# EAGLE design lpc1114 basic (EAGLE 6.3)
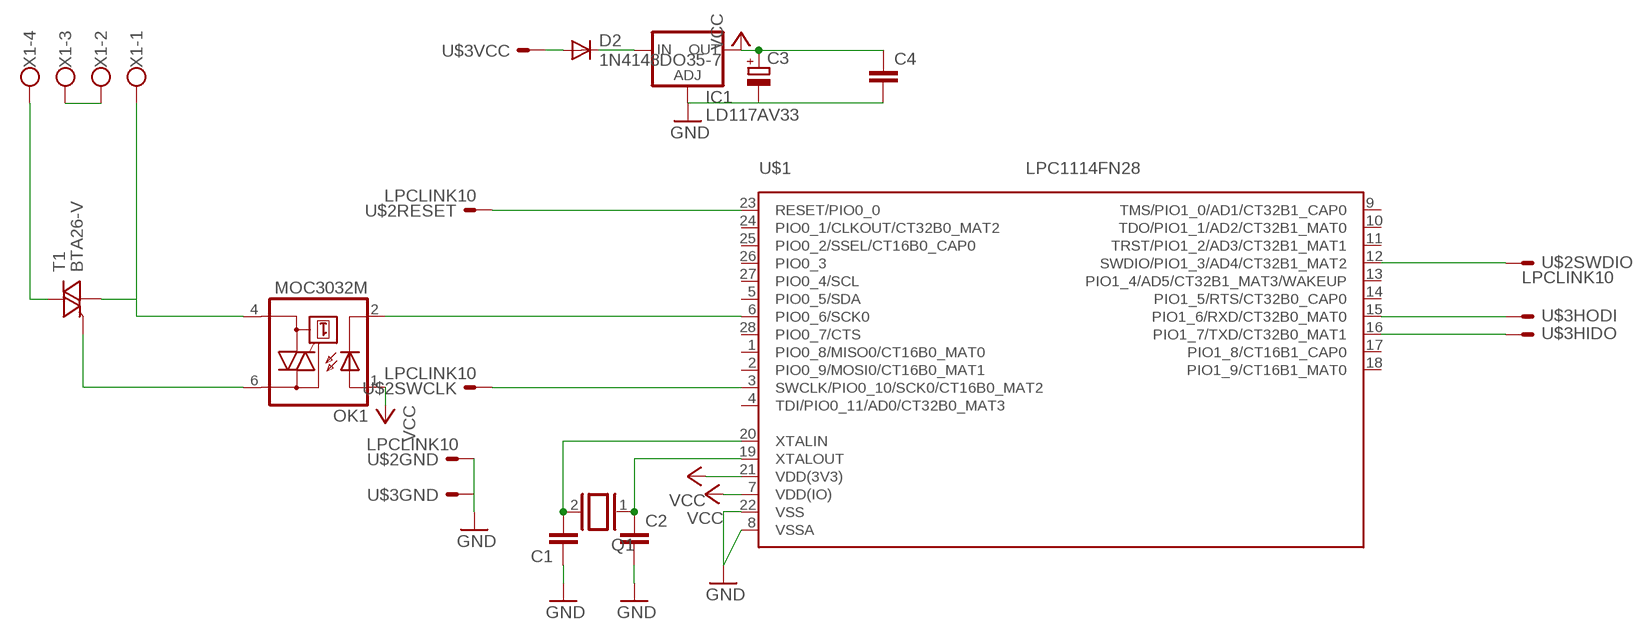
[diagram p0: schematic, sheet 1]

## Parts
C1  C-EU025-024X044  [C025-024X044]
C2  C-EU025-024X044  [C025-024X044]
C3  CPOL-EUTT2D6  [TT2D6]
C4  C-EU050-024X044  [C050-024X044]
D2  1N4148DO35-7  [DO35-7]
IC1  LD117AV33  [TO220L1]
OK1  MOC3032M  [DIL06]
Q1  XTAL/S  [QS]
T1  BTA26-V  [TOP3S-1]
U$1  LPC1114FN28  [DIP28]
U$2  LPCLINK10  [ML10]
U$3  UARTUSB  [PN61729]
X1  W237-4  [W237-4]

## Nets
GND: C1.1 C2.2 C3.- C4.2 IC1.1(ADJ) U$1.8(VSSA) U$1.22(VSS) U$2.9 U$3.4
N$1: C1.2 Q1.2 U$1.20(XTALIN)
N$2: C2.1 Q1.1 U$1.19(XTALOUT)
N$3: U$1.15(PIO1_6/RXD/CT32B0_MAT0) U$3.3
N$4: U$1.16(PIO1_7/TXD/CT32B0_MAT1) U$3.2
N$5: U$1.3(SWCLK/PIO0_10/SCK0/CT16B0_MAT2) U$2.4
N$6: U$1.12(SWDIO/PIO1_3/AD4/CT32B1_MAT2) U$2.2
N$7: U$1.23(RESET/PIO0_0) U$2.10
N$8: D2.A U$3.1
N$9: OK1.6(A2) T1.G
N$10: D2.C IC1.3(IN)
N$11: T1.A2 X1.4
N$12: OK1.2(C) U$1.6(PIO0_6/SCK0)
N$13: OK1.4(A1) T1.A1 X1.1
N$14: X1.2 X1.3
VCC: C3.+ C4.1 IC1.2(OUT) OK1.1(A) U$1.7(VDD(IO)) U$1.21(VDD(3V3))
Unconnected: U$1.1(PIO0_8/MISO0/CT16B0_MAT0) U$1.2(PIO0_9/MOSI0/CT16B0_MAT1) U$1.4(TDI/PIO0_11/AD0/CT32B0_MAT3) U$1.5(PIO0_5/SDA) U$1.9(TMS/PIO1_0/AD1/CT32B1_CAP0) U$1.10(TDO/PIO1_1/AD2/CT32B1_MAT0) U$1.11(TRST/PIO1_2/AD3/CT32B1_MAT1) U$1.13(PIO1_4/AD5/CT32B1_MAT3/WAKEUP) U$1.14(PIO1_5/RTS/CT32B0_CAP0) U$1.17(PIO1_8/CT16B1_CAP0) U$1.18(PIO1_9/CT16B1_MAT0) U$1.24(PIO0_1/CLKOUT/CT32B0_MAT2) U$1.25(PIO0_2/SSEL/CT16B0_CAP0) U$1.26(PIO0_3) U$1.27(PIO0_4/SCL) U$1.28(PIO0_7/CTS)

## Library data of the parts
C1 C2 C4 = rcl:C-EU: CAPACITOR, European symbol
C3 = rcl:CPOL-EU: POLARIZED CAPACITOR, European symbol
D2 = diode:1N4148: DIODE high speed (Philips)
IC1 = v-reg:LD117A?*: Low drop fixed and adjustable positive voltage regulators 1 A Source: http://www.st.com/stonline/products/literature/ds/7194/ld1117axx.pdf
OK1 = optocoupler:MOC30*: 6-Pin DIP Zero-Cross Optoisolators Triac Driver Output (250/400 Volt Peak) Source: http://www.fairchildsemi.com/ds/MO/MOC3043-M.pdf; MF: FAIRCHILD SEMICONDUCTOR; MPN: MOC3032-M; OC_FARNELL: 1203802; OC_NEWARK: 72K8897
Q1 = special:XTAL/S: CRYSTAL
T1 = triac:BTA26: 25A TRIAC Source: http://www.st.com/stonline/products/literature/ds/7470.pdf
U$1 = lieven:LPC1114FN28: LPC1114FN28
U$2 = lieven:LPCLINK10
U$3 = lieven:UARTUSB
X1 = con-wago-500:W237-4: WAGO SCREW CLAMP; OC_FARNELL: unknown; OC_NEWARK: unknown

## Board
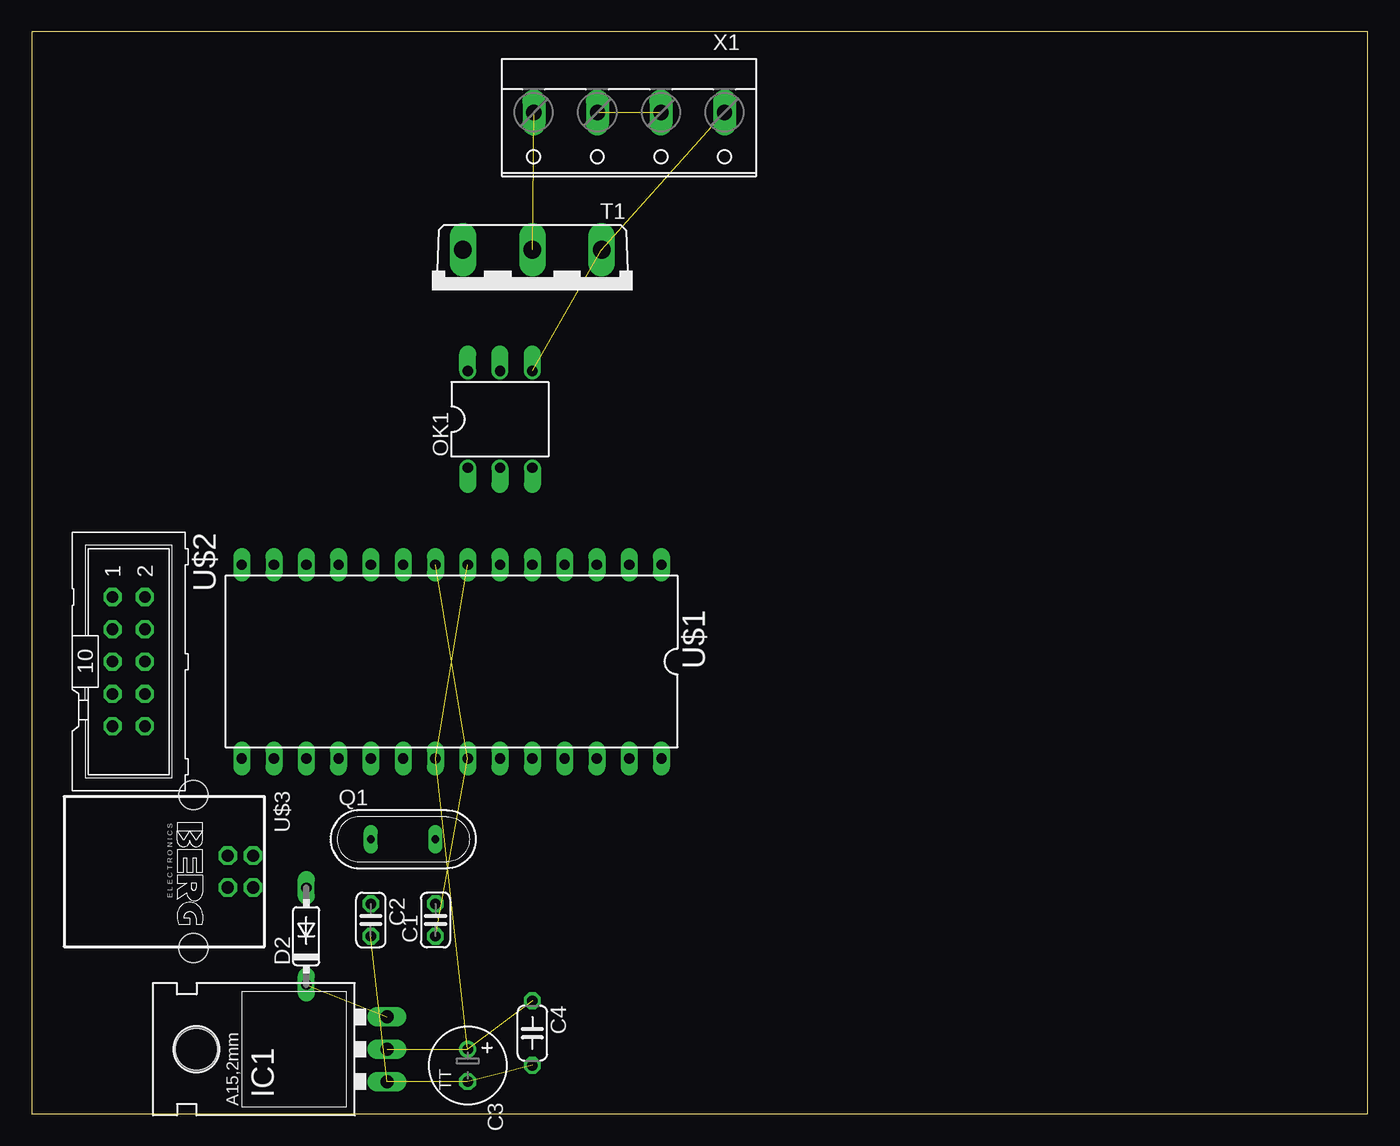
[diagram p1: board, top side]
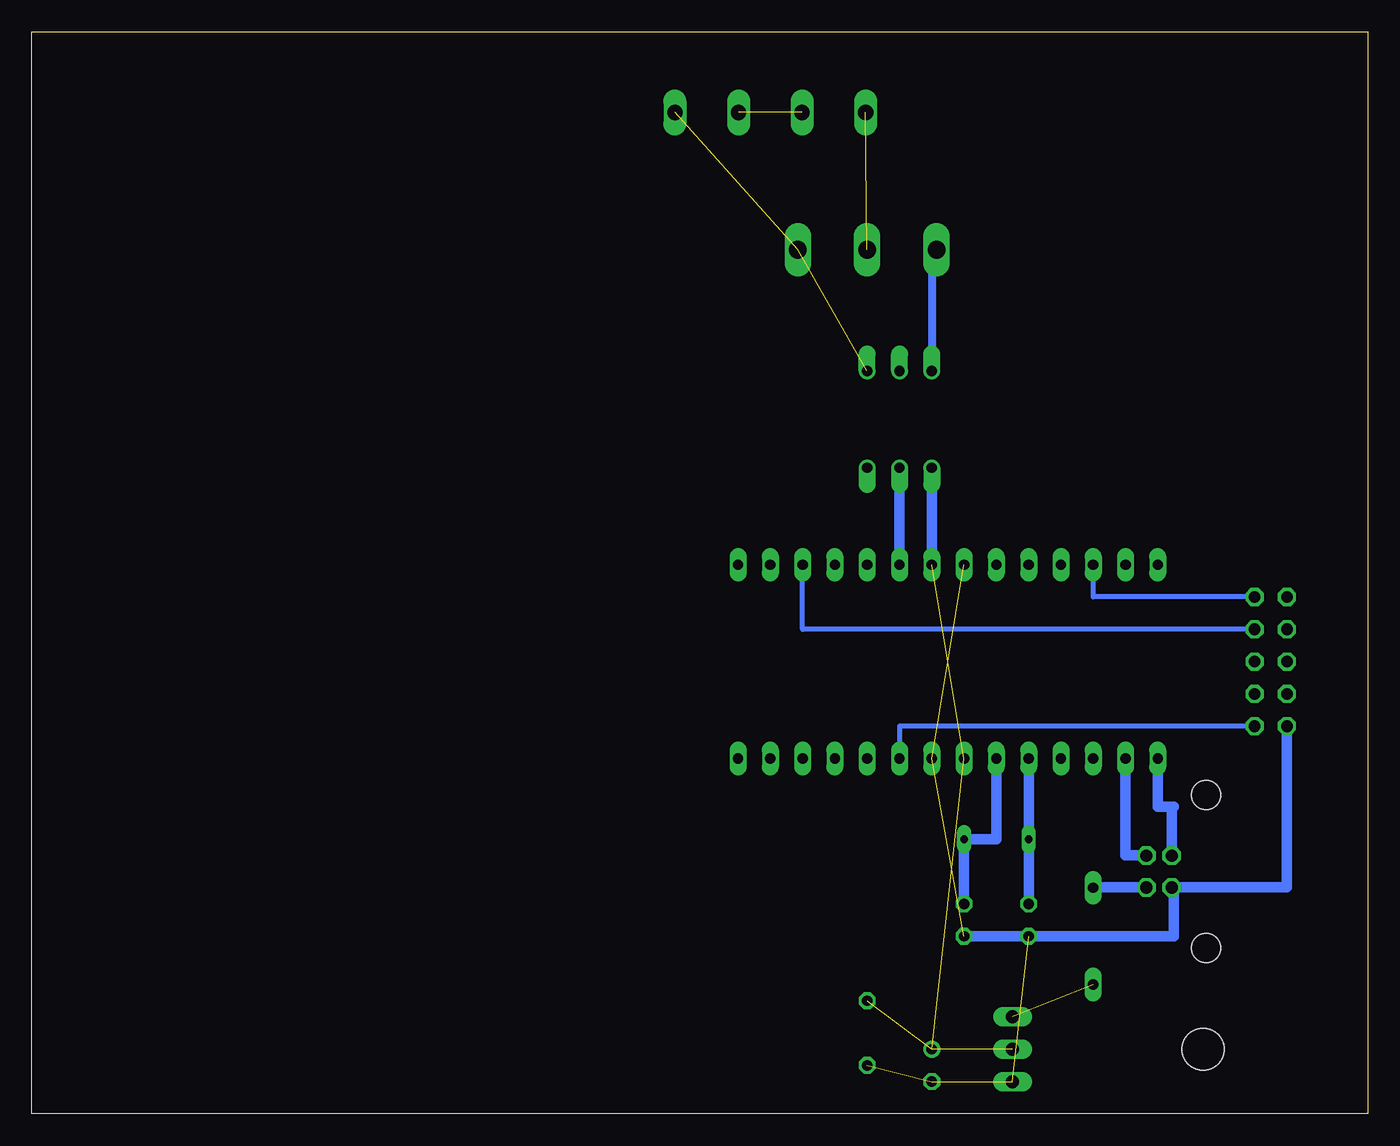
[diagram p2: board, bottom side, seen from below]

Size 105.08 x 85.08 mm. Coordinates in mm from the lower left corner, seen from the top.
Outline: 0,0 105.08,0 105.08,85.08 0,85.08 0,0
Copper layers (1*16): Top 0.035mm / dielectric 1.5mm / Bottom 0.035mm
Design rules "default": minimum track width 10mil, minimum drill 24mil, track to track 8mil, track to pad 8mil, pad to pad 8mil, via to via 8mil, smd to smd 8mil, copper to edge 40mil, drill to drill 8mil, minimum pad ring 10mil, minimum via ring 8mil, stop-mask expansion 4mil, vias tented up to drill 0mil, thermal gap 10mil

### Footprints (pad centres in the part's own frame; a part is rotated, then mirrored left to right if it is on the bottom)
C025-024X044 = drill 0.813 octagon: 1 -1.27,0; 2 1.27,0
TT2D6 = drill 0.813: + -1.27,0 | drill 0.813 octagon: - 1.27,0
C050-024X044 = drill 0.813 octagon: 1 -2.54,0; 2 2.54,0
DO35-7 = drill 0.813 long: A 3.81,0; C -3.81,0
TO220L1 = drill 1.016 long: 1 -2.54,-3.81; 2 0,-3.81; 3 2.54,-3.81 | hole 3.302: 0,11.176
DIL06 = drill 0.813 offset: 1 -2.54,-3.81; 2 0,-3.81; 3 2.54,-3.81; 4 2.54,3.81; 5 0,3.81; 6 -2.54,3.81
QS = drill 0.61 long: 1 -2.54,0; 2 2.54,0
TOP3S-1 = drill 1.397 long: A1 -5.461,-3.175; A2 0,-3.175; G 5.461,-3.175
DIP28 = drill 0.813 long: 1 -16.51,-7.62; 2 -13.97,-7.62; 3 -11.43,-7.62; 4 -8.89,-7.62; 5 -6.35,-7.62; 6 -3.81,-7.62; 7 -1.27,-7.62; 8 1.27,-7.62; 9 3.81,-7.62; 10 6.35,-7.62; 11 8.89,-7.62; 12 11.43,-7.62; 13 13.97,-7.62; 14 16.51,-7.62; 15 16.51,7.62; 16 13.97,7.62; 17 11.43,7.62; 18 8.89,7.62; 19 6.35,7.62; 20 3.81,7.62; 21 1.27,7.62; 22 -1.27,7.62; 23 -3.81,7.62; 24 -6.35,7.62; 25 -8.89,7.62; 26 -11.43,7.62; 27 -13.97,7.62; 28 -16.51,7.62
ML10 = drill 0.914 octagon: 1 -5.08,-1.27; 2 -5.08,1.27; 3 -2.54,-1.27; 4 -2.54,1.27; 5 0,-1.27; 6 0,1.27; 7 2.54,-1.27; 8 2.54,1.27; 9 5.08,-1.27; 10 5.08,1.27
PN61729 = drill 0.95 octagon: 1 1.25,4.71; 2 -1.25,4.71; 3 -1.25,2.71; 4 1.25,2.71 | hole 2.3: -6.02,0; 6.02,0
W237-4 = drill 1.194 long: 1 -7.5,-1.27; 2 -2.5,-1.27; 3 2.5,-1.27; 4 7.5,-1.27

### Placement (x,y rotation side)
C1  31.75,15.24 90 top
C2  26.67,15.24 270 top
C3  34.29,3.81 270 top
C4  39.37,6.35 270 top
D2  21.59,13.97 90 top
IC1  24.13,5.08 90 top
OK1  36.83,54.61 0 top
Q1  29.21,21.59 0 top
T1  39.37,64.77 180 top
U$1  33.02,35.56 180 top
U$2  7.62,35.56 270 top
U$3  12.7,19.05 270 top
X1  46.99,77.47 180 top

### Tracks (layer width: path | path; a pad name or v marks a point on that pad's centre or on a via)
GND  (5 unrouted)
  Bottom 0.813: U$2.9 6.35,17.8 U$3.4 15.24,17.8 15.24,13.97 C2.2 C1.1
N$1
  Bottom 0.813: C1.2 Q1.2 29.21,21.59 U$1.20
N$2
  Bottom 0.813: U$1.19 Q1.1 C2.1
N$3
  Bottom 0.813: U$1.15 16.51,24.13 15.41,24.13 | 15.24,24.13 15.41,24.13 | 15.41,24.13 U$3.3
N$4
  Bottom 0.813: U$1.16 19.05,20.32 17.41,20.32 U$3.2
N$5
  Bottom 0.406: U$2.4 44.45,38.1 U$1.3
N$6
  Bottom 0.406: U$2.2 21.59,40.64 U$1.12
N$7
  Bottom 0.406: U$2.10 36.83,30.48 U$1.23
N$8
  Bottom 0.813: U$3.1 21.59,17.8 D2.A
N$9
  Bottom 0.61: T1.G 34.29,67.94 OK1.6
N$10  (1 unrouted)
N$11  (1 unrouted)
N$12
  Bottom 0.813: U$1.6 OK1.2
N$13  (2 unrouted)
N$14  (1 unrouted)
VCC  (4 unrouted)
  Bottom 0.813: OK1.1 U$1.7